# EAGLE schematic SNES and NES Dumper (EAGLE 9.6.2)
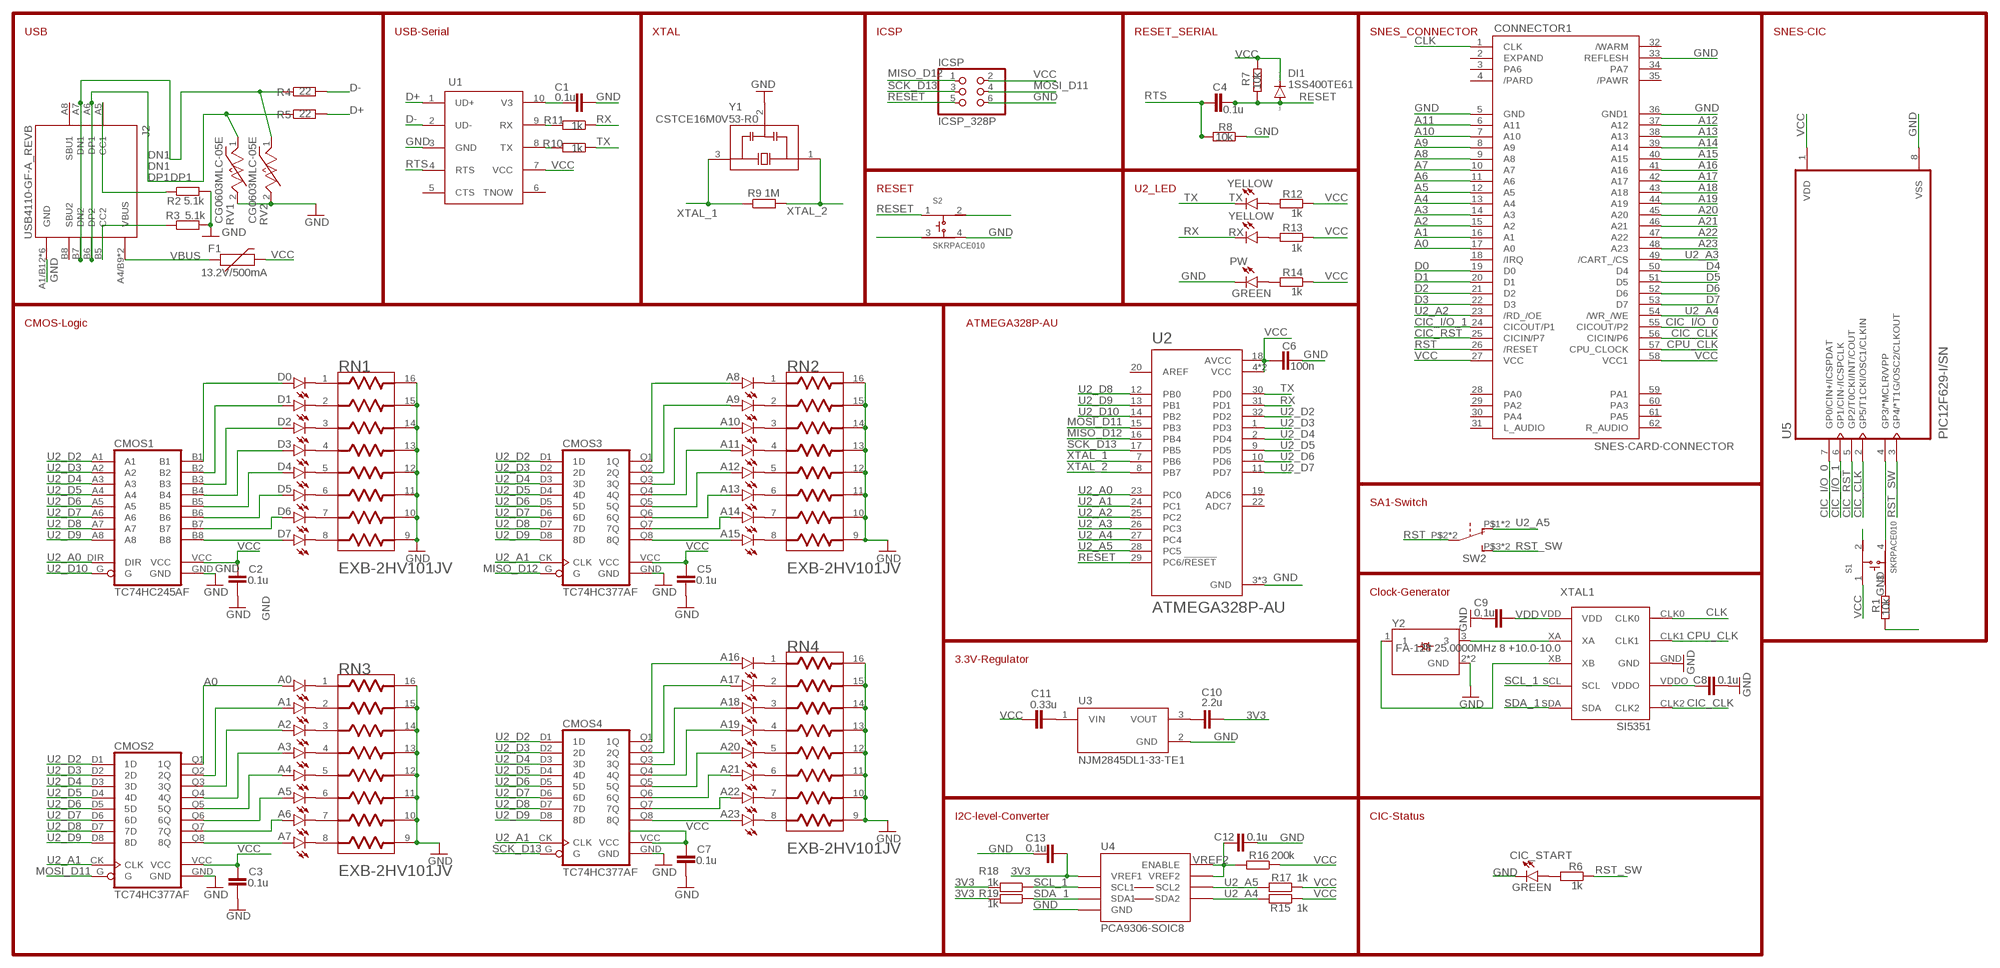
[diagram p0: schematic, sheet 1]

## Parts
A0  YELLOW  LEDSML0805  [SML0805]
A1  YELLOW  LEDSML0805  [SML0805]
A2  YELLOW  LEDSML0805  [SML0805]
A3  YELLOW  LEDSML0805  [SML0805]
A4  YELLOW  LEDSML0805  [SML0805]
A5  YELLOW  LEDSML0805  [SML0805]
A6  YELLOW  LEDSML0805  [SML0805]
A7  YELLOW  LEDSML0805  [SML0805]
A8  YELLOW  LEDSML0805  [SML0805]
A9  YELLOW  LEDSML0805  [SML0805]
A10  YELLOW  LEDSML0805  [SML0805]
A11  YELLOW  LEDSML0805  [SML0805]
A12  YELLOW  LEDSML0805  [SML0805]
A13  YELLOW  LEDSML0805  [SML0805]
A14  YELLOW  LEDSML0805  [SML0805]
A15  YELLOW  LEDSML0805  [SML0805]
A16  YELLOW  LEDSML0805  [SML0805]
A17  YELLOW  LEDSML0805  [SML0805]
A18  YELLOW  LEDSML0805  [SML0805]
A19  YELLOW  LEDSML0805  [SML0805]
A20  YELLOW  LEDSML0805  [SML0805]
A21  YELLOW  LEDSML0805  [SML0805]
A22  YELLOW  LEDSML0805  [SML0805]
A23  YELLOW  LEDSML0805  [SML0805]
C1  0.1u  C-EUC0603  [C0603]
C2  0.1u  C-EUC0603  [C0603]
C3  0.1u  C-EUC0603  [C0603]
C4  0.1u  C-EUC0603  [C0603]
C5  0.1u  C-EUC0603  [C0603]
C6  100n  C-EUC0603  [C0603]
C7  0.1u  C-EUC0603  [C0603]
C8  0.1u  C-EUC0603  [C0603]
C9  0.1u  C-EUC0603  [C0603]
C10  2.2u  C-EUC0603  [C0603]
C11  0.33u  C-EUC0603  [C0603]
C12  0.1u  C-EUC0603  [C0603]
C13  0.1u  C-EUC0603  [C0603]
CIC_START  GREEN  LEDSML0805  [SML0805]
CMOS1  TC74HC245AF  [SO20W]
CMOS2  TC74HC377AF  [SO20W]
CMOS3  TC74HC377AF  [SO20W]
CMOS4  TC74HC377AF  [SO20W]
CONNECTOR1  SNES-CARD-CONNECTOR  [CON]
D0  YELLOW  LEDSML0805  [SML0805]
D1  YELLOW  LEDSML0805  [SML0805]
D2  YELLOW  LEDSML0805  [SML0805]
D3  YELLOW  LEDSML0805  [SML0805]
D4  YELLOW  LEDSML0805  [SML0805]
D5  YELLOW  LEDSML0805  [SML0805]
D6  YELLOW  LEDSML0805  [SML0805]
D7  YELLOW  LEDSML0805  [SML0805]
DI1  1SS400TE61  DIODE-SOD523  [SOD523]
F1  13.2V/500mA  PPTC_THREE-QUARTER-AMP  [1206]
ICSP  ICSP_328P  PINHD-2X3  [2X03]
J2  USB4110-GF-A_REVB  [GCT_USB4110-GF-A_REVB]
PW  GREEN  LEDSML0805  [SML0805]
R1  10k  R-EU_R0603  [R0603]
R2  5.1k  R-EU_R0603  [R0603]
R3  5.1k  R-EU_R0603  [R0603]
R4  22  R-EU_R0603  [R0603]
R5  22  R-EU_R0603  [R0603]
R6  1k  R-EU_R0603  [R0603]
R7  10k  R-EU_R0603  [R0603]
R8  10k  R-EU_R0603  [R0603]
R9  1M  R-EU_R0603  [R0603]
R10  1k  R-EU_R0603  [R0603]
R11  1k  R-EU_R0603  [R0603]
R12  1k  R-EU_R0603  [R0603]
R13  1k  R-EU_R0603  [R0603]
R14  1k  R-EU_R0603  [R0603]
R15  1k  R-EU_R0603  [R0603]
R16  200k  R-EU_R0603  [R0603]
R17  1k  R-EU_R0603  [R0603]
R18  1k  R-EU_R0603  [R0603]
R19  1k  R-EU_R0603  [R0603]
RN1  PANASONIC_EXB-2HV101JVPANASONIC_EXB-2HV101JV_0_0  [PANASONIC_EXB-2HV101JV_0]
RN2  PANASONIC_EXB-2HV101JVPANASONIC_EXB-2HV101JV_0_0  [PANASONIC_EXB-2HV101JV_0]
RN3  PANASONIC_EXB-2HV101JVPANASONIC_EXB-2HV101JV_0_0  [PANASONIC_EXB-2HV101JV_0]
RN4  PANASONIC_EXB-2HV101JVPANASONIC_EXB-2HV101JV_0_0  [PANASONIC_EXB-2HV101JV_0]
RV1  CG0603MLC-05E  [VARC1608X56N]
RV2  CG0603MLC-05E  [VARC1608X56N]
RX  YELLOW  LEDSML0805  [SML0805]
S1  SKRPACE010  [SW_SKRPACE010]
S2  SKRPACE010  [SW_SKRPACE010]
SW2  ALPS_SSSS213202  [ALPS_SSSS213202]
TX  YELLOW  LEDSML0805  [SML0805]
U1  CH340E  CH340ESMD  [MSOP10]
U2  ATMEGA328P-AU  [QFP80P900X900X120-32N]
U3  NJM2845DL1-33-TE1  [DPAK228P968X238-4N]
U4  PCA9306-SOIC8  IC2_LEVEL_TRANSLATER  [SOIC-8]
U5  PIC12F629-I/SN  [SOIC127P600X175-8N]
XTAL1  SI5351  SI5351A-B-GTR  [SI5351A-B-GTR]
Y1  CSTCE16M0V53-R0  [OSC_CSTCE16M0V53-R0]
Y2  FA-128 25.0000MHz 8 +10.0-10.0  ABM8X-102-32.000MHZ-T  [OSCSC320X250X100N]

## Nets
3V3: C10.2 C13.2 R18.2 R19.2 U4.1(VREF1)
A0: A0.A CMOS2.Q1(1Q) CONNECTOR1.17(A0)
A1: A1.A CMOS2.Q2(2Q) CONNECTOR1.16(A1)
A2: A2.A CMOS2.Q3(3Q) CONNECTOR1.15(A2)
A3: A3.A CMOS2.Q4(4Q) CONNECTOR1.14(A3)
A4: A4.A CMOS2.Q5(5Q) CONNECTOR1.13(A4)
A5: A5.A CMOS2.Q6(6Q) CONNECTOR1.12(A5)
A6: A6.A CMOS2.Q7(7Q) CONNECTOR1.11(A6)
A7: A7.A CMOS2.Q8(8Q) CONNECTOR1.10(A7)
A8: A8.A CMOS3.Q1(1Q) CONNECTOR1.9(A8)
A9: A9.A CMOS3.Q2(2Q) CONNECTOR1.8(A9)
A10: A10.A CMOS3.Q3(3Q) CONNECTOR1.7(A10)
A11: A11.A CMOS3.Q4(4Q) CONNECTOR1.6(A11)
A12: A12.A CMOS3.Q5(5Q) CONNECTOR1.37(A12)
A13: A13.A CMOS3.Q6(6Q) CONNECTOR1.38(A13)
A14: A14.A CMOS3.Q7(7Q) CONNECTOR1.39(A14)
A15: A15.A CMOS3.Q8(8Q) CONNECTOR1.40(A15)
A16: A16.A CMOS4.Q1(1Q) CONNECTOR1.41(A16)
A17: A17.A CMOS4.Q2(2Q) CONNECTOR1.42(A17)
A18: A18.A CMOS4.Q3(3Q) CONNECTOR1.43(A18)
A19: A19.A CMOS4.Q4(4Q) CONNECTOR1.44(A19)
A20: A20.A CMOS4.Q5(5Q) CONNECTOR1.45(A20)
A21: A21.A CMOS4.Q6(6Q) CONNECTOR1.46(A21)
A22: A22.A CMOS4.Q7(7Q) CONNECTOR1.47(A22)
A23: A23.A CMOS4.Q8(8Q) CONNECTOR1.48(A23)
CIC_CLK: CONNECTOR1.56(CICIN/P6) U5.2(GP5/T1CKI/OSC1/CLKIN) XTAL1.CLK2
CIC_I/O_0: CONNECTOR1.55(CICOUT/P2) U5.7(GP0/CIN+/ICSPDAT)
CIC_I/O_1: CONNECTOR1.24(CICOUT/P1) U5.6(GP1/CIN-/ICSPCLK)
CIC_RST: CONNECTOR1.25(CICIN/P7) U5.5(GP2/T0CKI/INT/COUT)
CLK: CONNECTOR1.1(CLK) XTAL1.CLK0
CPU_CLK: CONNECTOR1.57(CPU_CLOCK) XTAL1.CLK1
D0: CMOS1.B1 CONNECTOR1.19(D0) D0.A
D1: CMOS1.B2 CONNECTOR1.20(D1) D1.A
D2: CMOS1.B3 CONNECTOR1.21(D2) D2.A
D3: CMOS1.B4 CONNECTOR1.22(D3) D3.A
D4: CMOS1.B5 CONNECTOR1.50(D4) D4.A
D5: CMOS1.B6 CONNECTOR1.51(D5) D5.A
D6: CMOS1.B7 CONNECTOR1.52(D6) D6.A
D7: CMOS1.B8 CONNECTOR1.53(D7) D7.A
D+: R5.2 U1.1(UD+)
D-: R4.2 U1.2(UD-)
DN1: J2.A7(DN1) J2.B7(DN2) R4.1 RV2.1
DP1: J2.A6(DP1) J2.B6(DP2) R5.1 RV1.1
GND: C1.2 C2.1 C3.1 C5.1 C6.2 C7.1 C8.1 C9.1 C12.1 C13.1 CIC_START.C CMOS1.GND CMOS2.GND CMOS3.GND CMOS4.GND CONNECTOR1.5(GND) CONNECTOR1.33(REFLESH) CONNECTOR1.36(GND1) ICSP.6 J2.A1/B12(GND) J2.B1/A12(GND) J2.S1(GND) J2.S2(GND) J2.S3(GND) J2.S4(GND) PW.C R1.2 R2.2 R3.2 R8.1 RN1.9 RN1.10 RN1.11 RN1.12 RN1.13 RN1.14 RN1.15 RN1.16 RN2.9 RN2.10 RN2.11 RN2.12 RN2.13 RN2.14 RN2.15 RN2.16 RN3.9 RN3.10 RN3.11 RN3.12 RN3.13 RN3.14 RN3.15 RN3.16 RN4.9 RN4.10 RN4.11 RN4.12 RN4.13 RN4.14 RN4.15 RN4.16 RV1.2 RV2.2 S2.3 S2.4 U1.3(GND) U2.3(GND) U2.5(GND) U2.21(GND) U3.2(GND) U4.4(GND) U5.8(VSS) XTAL1.GND Y1.2(GND) Y2.2(GND) Y2.4(GND)
MISO_D12: CMOS3.G ICSP.1 U2.16(PB4)
MOSI_D11: CMOS2.G ICSP.4 U2.15(PB3)
N$1: C1.1 U1.10(V3)
N$2: R11.2 U1.9(RX)
N$3: R10.2 U1.8(TX)
N$4: D0.C RN1.1
N$5: PW.A R14.2
N$6: D1.C RN1.2
N$7: D2.C RN1.3
N$8: D3.C RN1.4
N$9: D4.C RN1.5
N$10: D5.C RN1.6
N$11: D6.C RN1.7
N$12: D7.C RN1.8
N$13: A8.C RN2.1
N$14: A9.C RN2.2
N$15: A10.C RN2.3
N$16: A11.C RN2.4
N$17: A12.C RN2.5
N$18: A13.C RN2.6
N$19: A14.C RN2.7
N$20: A15.C RN2.8
N$21: R12.2 TX.A
N$22: J2.B5(CC2) R3.1
N$23: J2.A5(CC1) R2.1
N$24: A0.C RN3.1
N$25: A1.C RN3.2
N$26: A2.C RN3.3
N$27: A3.C RN3.4
N$28: A4.C RN3.5
N$29: A5.C RN3.6
N$30: A6.C RN3.7
N$31: A7.C RN3.8
N$32: A16.C RN4.1
N$33: A17.C RN4.2
N$34: A18.C RN4.3
N$35: A19.C RN4.4
N$36: A20.C RN4.5
N$37: A21.C RN4.6
N$38: A22.C RN4.7
N$39: A23.C RN4.8
N$40: XTAL1.XA Y2.3
N$41: XTAL1.XB Y2.1
N$42: R13.2 RX.A
N$43: C10.1 U3.3(VOUT)
N$44: C11.2 U3.1(VIN)
N$45: CIC_START.A R6.2
N$47: S1.4 U5.4(GP3/*MCLR/VPP)
N$48: R1.1 S1.3
RESET: C4.2 DI1.A ICSP.5 R7.1 S2.1 S2.2 U2.29(PC6/!RESET)
RST: CONNECTOR1.26(/RESET) SW2.P$2 SW2.P$5
RST_SW: R6.1 SW2.P$3 SW2.P$4 U5.3(GP4/*T1G/OSC2/CLKOUT)
RTS: C4.1 R8.2 U1.4(RTS)
RX: R11.1 RX.C U2.31(PD1)
SCK_D13: CMOS4.G ICSP.3 U2.17(PB5)
SCL_1: R18.1 U4.2(SCL1) XTAL1.SCL
SDA_1: R19.1 U4.3(SDA1) XTAL1.SDA
TX: R10.1 TX.C U2.30(PD0)
U2_A0: CMOS1.DIR U2.23(PC0)
U2_A1: CMOS2.CK(CLK) CMOS3.CK(CLK) CMOS4.CK(CLK) U2.24(PC1)
U2_A2: CONNECTOR1.23(/RD_/OE) U2.25(PC2)
U2_A3: CONNECTOR1.49(/CART_/CS) U2.26(PC3)
U2_A4: CONNECTOR1.54(/WR_/WE) R15.2 U2.27(PC4) U4.5(SDA2)
U2_A5: R17.2 SW2.P$1 SW2.P$6 U2.28(PC5) U4.6(SCL2)
U2_D2: CMOS1.A1 CMOS2.D1(1D) CMOS3.D1(1D) CMOS4.D1(1D) U2.32(PD2)
U2_D3: CMOS1.A2 CMOS2.D2(2D) CMOS3.D2(2D) CMOS4.D2(2D) U2.1(PD3)
U2_D4: CMOS1.A3 CMOS2.D3(3D) CMOS3.D3(3D) CMOS4.D3(3D) U2.2(PD4)
U2_D5: CMOS1.A4 CMOS2.D4(4D) CMOS3.D4(4D) CMOS4.D4(4D) U2.9(PD5)
U2_D6: CMOS1.A5 CMOS2.D5(5D) CMOS3.D5(5D) CMOS4.D5(5D) U2.10(PD6)
U2_D7: CMOS1.A6 CMOS2.D6(6D) CMOS3.D6(6D) CMOS4.D6(6D) U2.11(PD7)
U2_D8: CMOS1.A7 CMOS2.D7(7D) CMOS3.D7(7D) CMOS4.D7(7D) U2.12(PB0)
U2_D9: CMOS1.A8 CMOS2.D8(8D) CMOS3.D8(8D) CMOS4.D8(8D) U2.13(PB1)
U2_D10: CMOS1.G U2.14(PB2)
VBUS: F1.1 J2.A4/B9(VBUS) J2.B4/A9(VBUS)
VCC: C2.2 C3.2 C5.2 C6.1 C7.2 C11.1 CMOS1.VCC CMOS2.VCC CMOS3.VCC CMOS4.VCC CONNECTOR1.27(VCC) CONNECTOR1.58(VCC1) DI1.C F1.2 ICSP.2 R7.2 R12.1 R13.1 R14.1 R15.1 R16.1 R17.1 S1.1 S1.2 U1.7(VCC) U2.4(VCC) U2.6(VCC) U2.18(AVCC) U5.1(VDD)
VDD: C9.2 XTAL1.VDD
VDDO: C8.2 XTAL1.VDDO
VREF2: C12.2 R16.2 U4.7(VREF2) U4.8(ENABLE)
XTAL_1: R9.1 U2.7(PB6) Y1.3(OUT)
XTAL_2: R9.2 U2.8(PB7) Y1.1(IN)
Unconnected: CONNECTOR1.2(EXPAND) CONNECTOR1.3(PA6) CONNECTOR1.4(/PARD) CONNECTOR1.18(/IRQ) CONNECTOR1.28(PA0) CONNECTOR1.29(PA2) CONNECTOR1.30(PA4) CONNECTOR1.31(L_AUDIO) CONNECTOR1.32(/WARM) CONNECTOR1.34(PA7) CONNECTOR1.35(/PAWR) CONNECTOR1.59(PA1) CONNECTOR1.60(PA3) CONNECTOR1.61(PA5) CONNECTOR1.62(R_AUDIO) J2.A8(SBU1) J2.B8(SBU2) U1.5(CTS) U1.6(TNOW) U2.19(ADC6) U2.20(AREF) U2.22(ADC7)

## Notes on the sheet
- USB | USB-Serial | XTAL | ICSP | RESET_SERIAL | SNES_CONNECTOR | SNES-CIC
- RESET | U2_LED
- CMOS-Logic | ATMEGA328P-AU
- SA1-Switch
- Clock-Generator
- 3.3V-Regulator
- I2C-level-Converter | CIC-Status

## Library data of the parts
A0 A1-A23 CIC_START D0 D1-D7 PW RX TX = led:LED: LED OSRAM: - CHIPLED LG R971, LG N971, LY N971, LG Q971, LY Q971, LO R971, LY R971 LH N974, LH R974 LS Q976, LO Q976, LY Q976 LO Q996 - Hyper CHIPLED LW Q18S LB Q993, LB Q99A, LB R99A - SideLED LS A670, LO A670, LY A670, LG A670, LP A670 LB A673, LV A673, LT A673, LW A673 LH A674 LY A675 LS A676, LA A676, LO A676, LY A676, LW A676 LS A679, LY A679, LG A679 - Hyper Micro SIDELED® LS Y876, LA Y876, LO Y876, LY Y876 LT Y87S - SmartLED LW L88C, LW L88S LB L89C, LB L89S, LG L890 LS L89K, LO L89K, LY L89K LS L896, LA L896, LO L896, LY L896 - TOPLED LS T670, LO T670, LY T670, LG T670, LP T670 LSG T670, LSP T670, LSY T670, LOP T670, LYG T670 LG T671, LOG T671, LSG T671 LB T673, LV T673, LT T673, LW T673 LH T674 LS T676, LA T676, LO T676, LY T676, LB T676, LH T676, LSB T676, LW T676 LB T67C, LV T67C, LT T67C, LS T67K, LO T67K, LY T67K, LW E67C LS E67B, LA E67B, LO E67B, LY E67B, LB E67C, LV E67C, LT E67C LW T67C LS T679, LY T679, LG T679 LS T770, LO T770, LY T770, LG T770, LP T770 LB T773, LV T773, LT T773, LW T773 LH T774 LS E675, LA E675, LY E675, LS T675 LS T776, LA T776, LO T776, LY T776, LB T776 LHGB T686 LT T68C, LB T68C - Hyper Mini TOPLED® LB M676 - Mini TOPLED Santana® LG M470 LS M47K, LO M47K, LY M47K Source: http://www.osram.convergy.de LUXEON: - LUMILED® LXK2-PW12-R00, LXK2-PW12-S00, LXK2-PW14-U00, LXK2-PW14-V00 LXK2-PM12-R00, LXK2-PM12-S00, LXK2-PM14-U00 LXK2-PE12-Q00, LXK2-PE12-R00, LXK2-PE12-S00, LXK2-PE14-T00, LXK2-PE14-U00 LXK2-PB12-K00, LXK2-PB12-L00, LXK2-PB12-M00, LXK2-PB14-N00, LXK2-PB14-P00, LXK2-PB14-Q00 LXK2-PR12-L00, LXK2-PR12-M00, LXK2-PR14-Q00, LXK2-PR14-R00 LXK2-PD12-Q00, LXK2-PD12-R00, LXK2-PD12-S00 LXK2-PH12-R00, LXK2-PH12-S00 LXK2-PL12-P00, LXK2-PL12-Q00, LXK2-PL12-R00 Source: www.luxeon.com KINGBRIGHT: KA-3528ASYC Source: www.kingbright.com
C1-C13 = rcl:C-EU: CAPACITOR, European symbol; SPICEPREFIX: C
CMOS1 = TC74HC245AF:TC74HC245AF
CMOS2-CMOS4 = TC74HC377AF:TC74HC377AF
CONNECTOR1 = SNES-CONNECTOR:SNES-CARD-CONNECTOR: <SNES-CONNECTOR> Pitch:2.5mm Drill:0.6mm Test:https://ja.aliexpress.com/item/32914744213.html?spm=a2g0o.order_detail.0.0.1e441691wRdrKb&gatewayAdapt=glo2jpn
DI1 = diode:DIODE-: DIODE
F1 = SparkFun-Fuses:PPTC: Resettable Fuse PPTC Resettable Fuse. Really a sort of resistor with a polymeric positive temperature coefficient whose resistance increases dramatically with an increase in temperature. When heated by the power passing through the resistance rises causing the current to be limited, protecting the circuit. This is achieved by the transition of the polymer from a crystalline to an amorphous state where the conductive carbon separates breaking the conductive pathways found in the cool crystalline structure. When a PPTC cools back down it resumes conducting letting the circuit turn back on. SparkFun Products: SparkFun RedBoard - Programmed with Arduino <https://www.sparkfun.com/products/12757> Pro Micro - 5V/16MHz <https://www.sparkfun.com/products/12640> Arduino Pro 328 - 5V/16MHz <https://www.sparkfun.com/products/10915> MP3 Trigger <https://www.sparkfun.com/products/13720>; PROD_ID: RES-11150; VALUE: 6V/0.75A
ICSP = pinhead:PINHD-2X3: PIN HEADER
J2 = USB4110-GF-A_REVB:USB4110-GF-A_REVB: Check availability <https://pricing.snapeda.com/parts/USB4110-GF-A/GCT/view-part?ref=eda>; AVAILABILITY: In Stock; DESCRIPTION: USB-C (USB TYPE-C) USB 2.0 Receptacle Connector 24 (16+8 Dummy) Position Surface Mount, Right Angle; Through Hole; MF: GCT; MP: USB4110-GF-A; PACKAGE: None; PRICE: None; PURCHASE-URL: https://pricing.snapeda.com/search/part/USB4110-GF-A/?ref=eda
R1-R19 = rcl:R-EU_: RESISTOR, European symbol; SPICEPREFIX: R
RN1-RN4 = Panasonic - EXB-2HV101JV:PANASONIC_EXB-2HV101JV: Resistor Thick Film Array 100 Ohm 5% 1/4W 200ppm/C ISOL 16-Pin 1506(8 X 0402) Convex SMD Punched Carrier T/R; AUTOMOTIVE: Yes; AUTOMOTIVE_GRADE: Grade 1; CENTROID_NOT_SPECIFIED: No; COMPOSITION: Thick Film; DATASHEET: https://industrial.panasonic.com/cdbs/www-data/pdf/AOC0000/AOC0000C14.pdf; DEVICE_CLASS_L1: Passive Components; DEVICE_CLASS_L2: Resistors; DEVICE_CLASS_L3: Resistor Arrays; DIGIKEY_DESCRIPTION: RES ARRAY 8 RES 100 OHM 1506; DIGIKEY_PART_NUMBER: Y1101CT-ND; FOOTPRINT_VARIANT_NAME_0: Recommended_Land_Pattern; HEIGHT: 0.55mm; LEAD_FREE: Yes; MF: Panasonic; MFG_PACKAGE_IDENT: EXB2HV; MFG_PACKAGE_IDENT_COMPONENT_ID: d9f61f0f8aa83a95; MFG_PACKAGE_IDENT_DATE: 0; MFG_PACKAGE_IDENT_REV: 0; MOUSER_DESCRIPTION: Resistor Networks & Arrays 100 OHM 5%; MOUSER_PART_NUMBER: 667-EXB-2HV101JV; MPN: EXB-2HV101JV; NUMBER_OF_RESISTORS: 8; PACKAGE: 1506; POWER_PER_RESISTOR: 0.063W; POWER_RATING: 0.25W; PREFIX: RN; RESISTANCE: 100Ω; ROHS: Yes; SERIES: EXB; TEMPERATURE_COEFFICIENT: 200ppm/°C; TEMPERATURE_RANGE_HIGH: +125°C; TEMPERATURE_RANGE_LOW: -55°C; TERMINATION: Convex; TOLERANCE: 5%; VERIFICATION_VERSION: 0.0.0.3; VOLTAGE_RATING: 25V
RV1 RV2 = CG0603MLC-05E:CG0603MLC-05E: Varistor 1 Circuit Surface Mount, MLCV 0603 (1608 Metric) Check availability <https://pricing.snapeda.com/parts/CG0603MLC-05E/Bourns/view-part?ref=eda>; AVAILABILITY: In Stock; DESCRIPTION: Varistor 1 Circuit Surface Mount, MLCV 0603 (1608 Metric); MF: Bourns; MP: CG0603MLC-05E; PACKAGE: 0603 Bourns Inc.; PRICE: None; PURCHASE-URL: https://pricing.snapeda.com/search/part/CG0603MLC-05E/?ref=eda
S1 S2 = SKRPACE010:SKRPACE010: Switch Tactile N.O. SPST Button J-Bend 0.05A 16VDC 2.55N SMD Automotive T/R Check prices <https://pricing.snapeda.com/parts/SKRPACE010/ALPS/view-part?ref=eda>; AVAILABILITY: In Stock; DESCRIPTION: Switch Tactile N.O. SPST Button J-Bend 0.05A 16VDC 2.55N SMD Automotive T/R; MF: ALPS; MP: SKRPACE010; PACKAGE: None; PRICE: None
SW2 = ALPS_SSSS213202:ALPS_SSSS213202
U1 = CH340E:CH340E: WCH.CN/CH340E See DataSheet： wch.cn <http://www.wch.cn/downloads/CH340DS1_PDF.html> Check availability <https://pricing.snapeda.com/parts/CH340E/WCH/view-part?ref=eda>; AVAILABILITY: Not in stock; DESCRIPTION: USB to serial chip CH340; MF: WCH; MP: CH340E; PACKAGE: Package; PRICE: None
U2 = ATMEGA328P-AU:ATMEGA328P-AU: ATmega Series 20 MHz 32 KB Flash 2 KB SRAM 8-Bit Microcontroller - TQFP-32 Check availability <https://pricing.snapeda.com/parts/ATMEGA328P-AU/Microchip%20Technology/view-part?ref=eda>; AVAILABILITY: In Stock; DESCRIPTION: AVR AVR® ATmega Microcontroller IC 8-Bit 20MHz 32KB (16K x 16) FLASH 32-TQFP (7x7); MF: Microchip Technology; MP: ATMEGA328P-AU; PACKAGE: TQFP-32 Microchip; PRICE: None; PURCHASE-URL: https://pricing.snapeda.com/search/part/ATMEGA328P-AU/?ref=eda
U3 = NJM2845DL1-33-TE1:NJM2845DL1-33-TE1: NJM2845 Series 800 mA 3.3 V Fixed Output SMT LDO Regulator - TO-252 Check availability <https://pricing.snapeda.com/parts/NJM2845DL1-33-TE1/NJR%20Corporation/NJRC/view-part?ref=eda>; AVAILABILITY: In Stock; DESCRIPTION: Linear Voltage Regulator IC 1 Output 800mA TO-252-3; MF: NJR Corporation/NJRC; MP: NJM2845DL1-33-TE1; PACKAGE: TO-252-3 New Japan Radio; PRICE: None; PURCHASE-URL: https://pricing.snapeda.com/search/part/NJM2845DL1-33-TE1/?ref=eda
U4 = srg:IC2_LEVEL_TRANSLATER: I2C Level Translator PCA9306 Data Sheet <http://www.ti.com/lit/ds/symlink/pca9306.pdf> Sparkfun breakout board schematic <http://dlnmh9ip6v2uc.cloudfront.net/datasheets/BreakoutBoards/PCA9306_Breakout.pdf>
U5 = PIC12F629-I_SN:PIC12F629-I/SN: Check availability <https://pricing.snapeda.com/parts/PIC12F629-I/SN/Microchip/view-part?ref=eda>; AVAILABILITY: In Stock; DESCRIPTION: PIC PIC® 12F Microcontroller IC 8-Bit 20MHz 1.75KB (1K x 14) FLASH 8-SOIC; MF: Microchip; MP: PIC12F629-I/SN; PACKAGE: SOIC-8 Microchip; PRICE: None; PURCHASE-URL: https://pricing.snapeda.com/search/part/PIC12F629-I/SN/?ref=eda
XTAL1 = SI5351:SI5351A-B-GTR
Y1 = CSTCE16M0V53-R0:CSTCE16M0V53-R0: 20MHz Ceramic Resonator Built in Capacitor 15pF +/- 0.2% -40C - 125C Surface Mount Check prices <https://pricing.snapeda.com/parts/CSTCE16M0V53-R0/Murata/view-part?ref=eda>; AVAILABILITY: Not in stock; DESCRIPTION: 16MHz Ceramic Resonator Built in Capacitor 15pF ±0.3% -20°C ~ 80°C Surface Mount; MF: Murata; MP: CSTCE16M0V53-R0; PACKAGE: SMD-3 Murata; PRICE: None
Y2 = ABM8X-102-32.000MHZ-T:ABM8X-102-32.000MHZ-T: Crystal 20MHz Â±20ppm (Tol) Â±30ppm (Stability) 18pF FUND 80Ohm 4-Pin Mini-CSMD T/R Check availability <https://pricing.snapeda.com/parts/ABM8X-102-32.000MHZ-T/Abracon/view-part?ref=eda>; AVAILABILITY: In Stock; DESCRIPTION: 32 MHz ±10ppm Crystal 10pF 60 Ohms 4-SMD, No Lead; MF: Abracon; MP: ABM8X-102-32.000MHZ-T; PACKAGE: SMD-4 Abracon; PRICE: None; PURCHASE-URL: https://pricing.snapeda.com/search/part/ABM8X-102-32.000MHZ-T/?ref=eda